# Altium schematic sheet Sensor.SchDoc
size A4
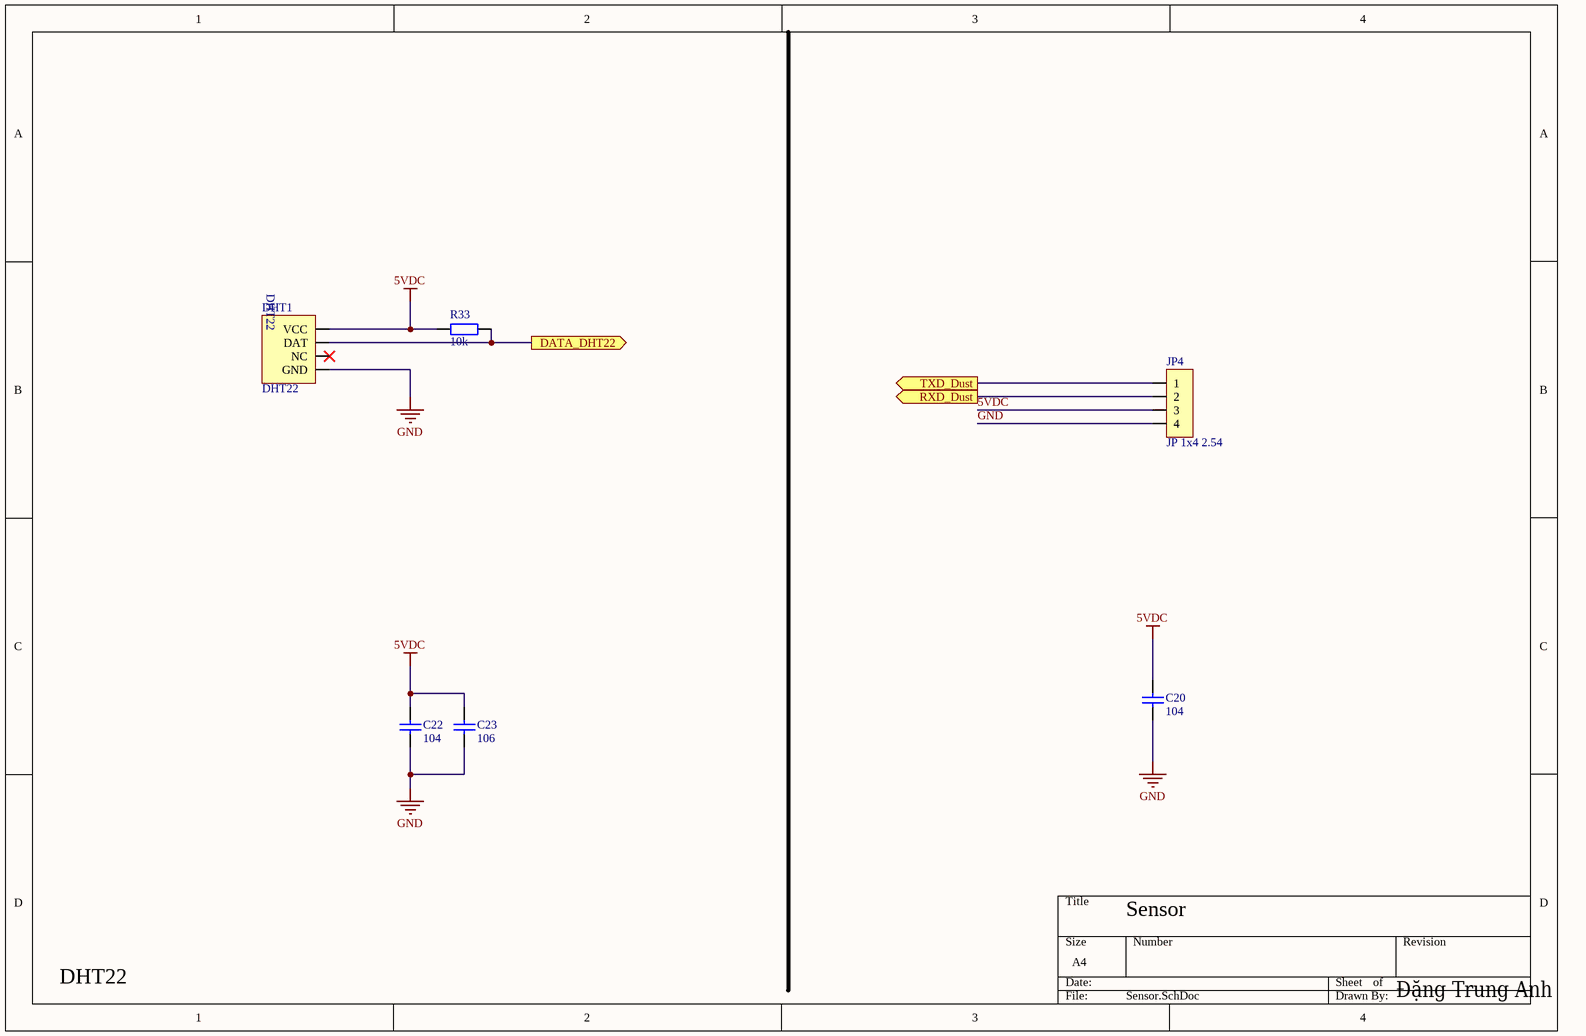
[diagram p0: Sensor.SchDoc]

## Parts
C20  104  [tu 0603]
C22  104  [tu 0603]
C23  106  [tu 0603]
DHT1  DHT22  [DHT22]
JP4  JP 1x4 2.54  [JP 1x4 DC]
R33  10k  [tro smd 0603]

## Ports
DATA_DHT22 (out), RXD_Dust (out), TXD_Dust (out)

## Nets
5VDC: C20.1 C22.1 C23.1 DHT1.1(VCC) JP4.3 R33.2
GND: C20.2 C22.2 C23.2 DHT1.4(GND) JP4.4
DATA_DHT22: DHT1.2(DAT) R33.1 ; port DATA_DHT22
RXD_Dust: JP4.2 ; port RXD_Dust
TXD_Dust: JP4.1 ; port TXD_Dust

Not connected (* = marked no-connect by the designer): DHT1 3(NC)*

## Notes on the sheet
- Sensor
- DHT22
- Đặng Trung Anh

## Library data of the parts
C20 C22 = Tu 0603 104 50V 10%: Dán; Don_Vi: Con; So_Chan: 2; Ten_Linh_Kien: Tụ 0603 104-100nF 10% 50V; Ma_Hang: MH004568; Chung_Loai: Dán; Kieu_Chan: *
C23 = Tu 0603 106 16V 20%: Dán; Don_Vi: Con; So_Chan: 2; Ten_Linh_Kien: Tụ 0603-10uF 20% 16V; Ma_Hang: MH004848; Chung_Loai: Dán; Kieu_Chan: *
DHT1 = DHT22: Manufacturer: W¨¹rth Elektronik eiSos GmbH; partNo: 613004143121; ComponentLink1 Description: Manufacturer; ComponentLink2 Description: Datasheet; NoPins: 04; Created Date: 29 March 2013; ComponentLink1URL: http://www.we-online.com; ComponentLink2URL: http://katalog.we-online.de/em/datasheet/6130xx143121.pdf; Created by: Karrer Zheng
JP4 = JP 1x4 2.54 Duc Cong: Cắm; Ten_Linh_Kien: Jump Đơn Đực 2.54MM 1x40P Cong Đứng; Don_Vi: Con; Ma_Hang: MH000904; Ghi_Chu: *; Kieu_Chan: *; Chung_Loai: Cắm
R33 = Tro 0603 1% 10k: Dán; Don_Vi: Con; So_Chan: 2; Ten_Linh_Kien: Trở 0603 1% 10k; Ma_Hang: MH006333; Chung_Loai: Dán; Kieu_Chan: *